# EAGLE design os21_diy (EAGLE 6.5.0)
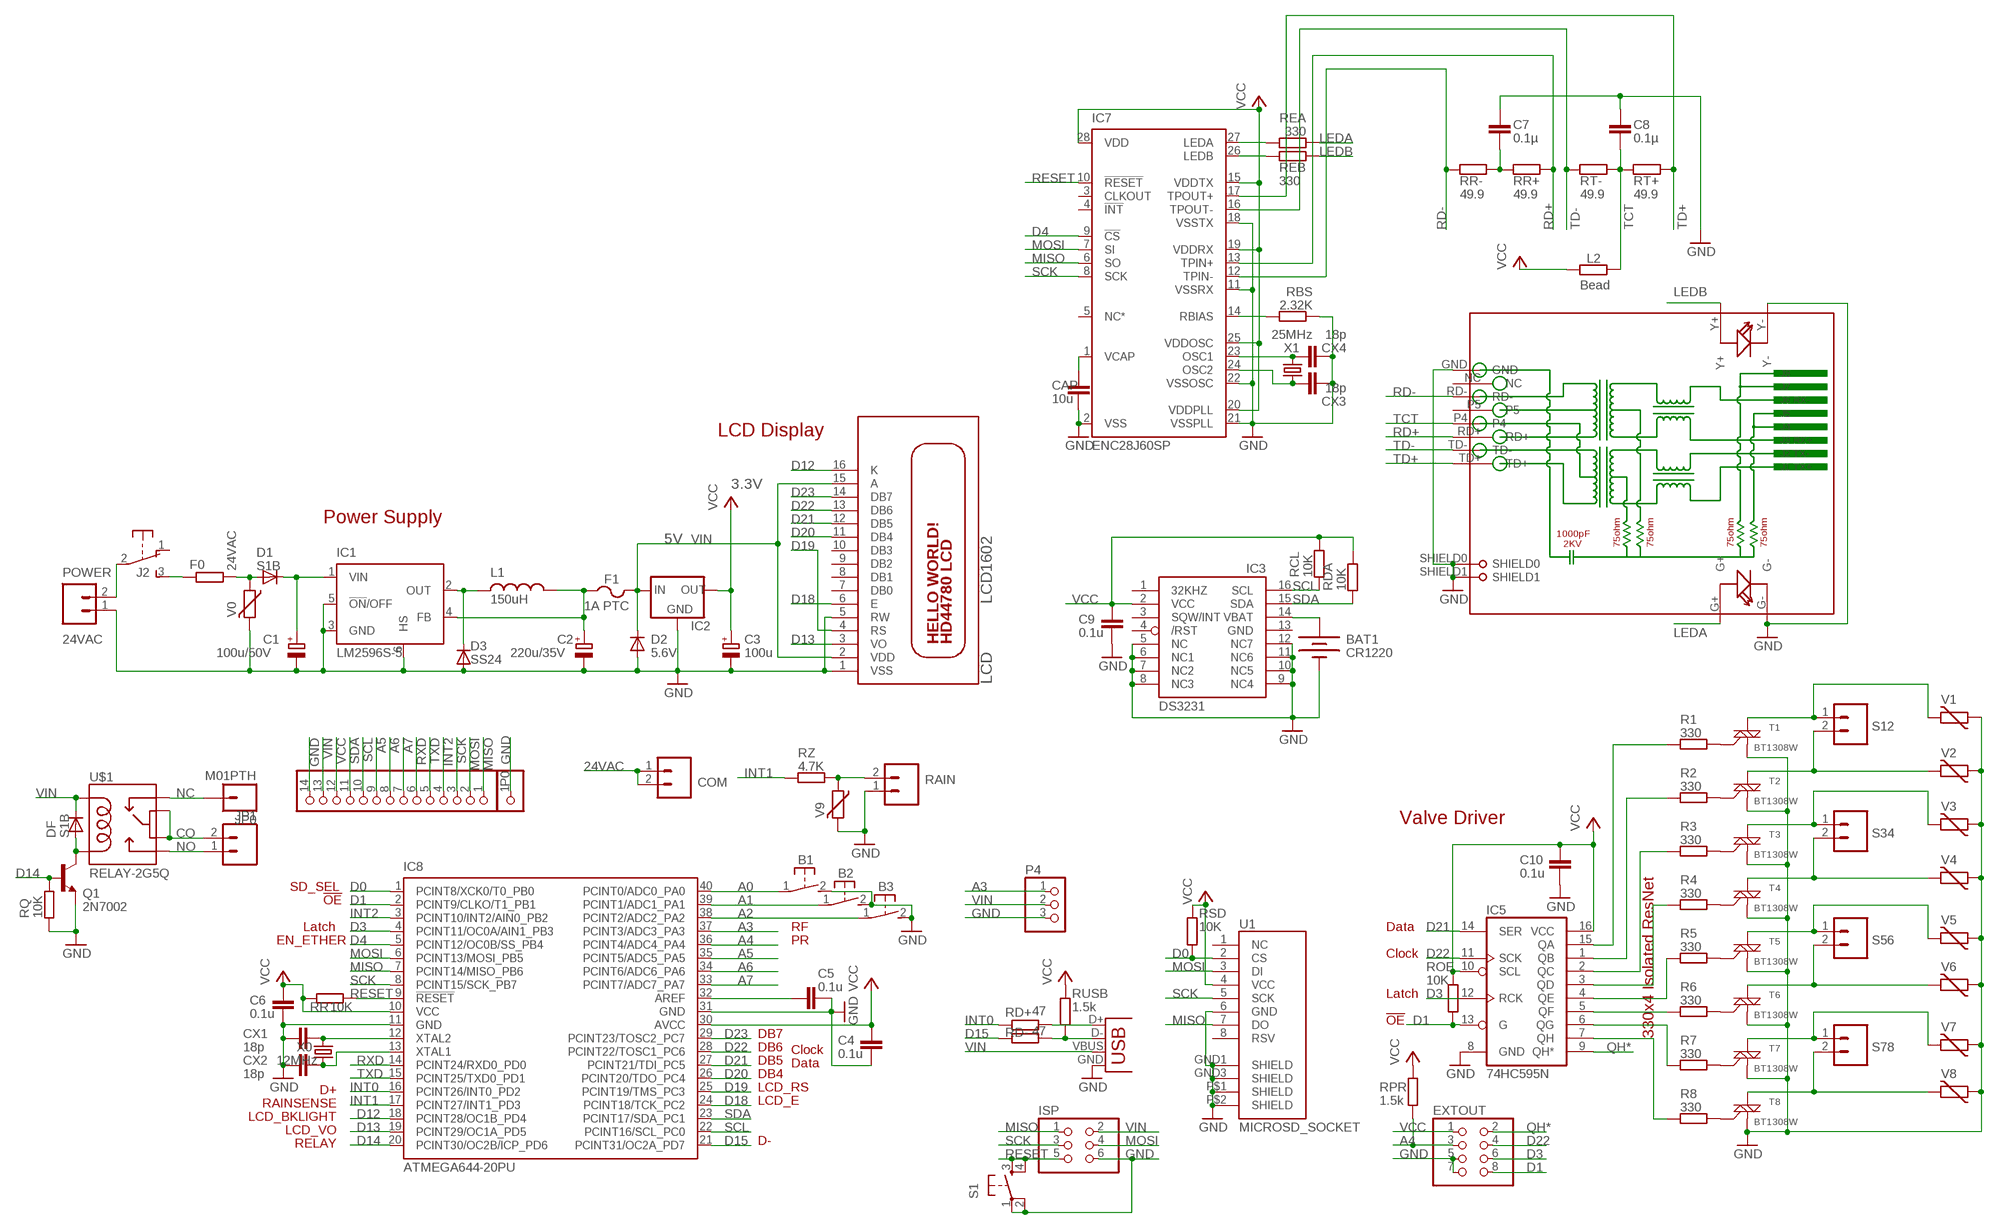
[diagram p0: schematic, sheet 1]

## Parts
B1  31-XX  [B3F-31XX]
B2  31-XX  [B3F-31XX]
B3  31-XX  [B3F-31XX]
BAT1  CR1220  BATTERYBATTERY_12MM_SMT  [BATTCON_12MM_SMT]
C1  100u/50V  CPOL-EUE3.5-8  [E3,5-8]
C2  220u/35V  CPOL-EUE3.5-8  [E3,5-8]
C3  100u  CPOL-EUE2-5  [E2-5]
C4  0.1u  C-EUC0805  [C0805]
C5  0.1u  C-EUC0805  [C0805]
C6  0.1u  C-EUC0805  [C0805]
C7  0.1µ  C-EUC0805  [C0805]
C8  0.1µ  C-EUC0805  [C0805]
C9  0.1u  C-EUC0805  [C0805]
C10  0.1u  C-EUC0805  [C0805]
CAP  10u  C-EUC0805  [C0805]
COM  M025MM-X  [SCREWTERMINAL-5MM-2-X]
CX1  18p  C-EUC0805  [C0805]
CX2  18p  C-EUC0805  [C0805]
CX3  18p  C-EUC0805  [C0805]
CX4  18p  C-EUC0805  [C0805]
D1  S1B  DIODE-DO-214AC  [DO-214AC]
D2  5.6V  DIODE-MINIMELF  [MINIMELF]
D3  SS24  DIODE-DO-214AC  [DO-214AC]
DF  S1B  DIODE-DO-214AC  [DO-214AC]
EXTOUT  PINHD-2X4  [2X04]
F0  R-EU_0411/3V  [0411V]
F1  1A PTC  PTCFUSE-1812  [1812]
IC1  LM2596S-5  LM2596S  [TO263-5]
IC2  MCP1700SOT233  [SOT23]
IC3  DS3231/SO  [SO16W]
IC5  74HC595N  74LS595D  [SO16]
IC7  ENC28J60SP  [DIL28-3]
IC8  ATMEGA644-20PU  [DIL40]
ISP  PINHD-2X3  [2X03]
J2  EG1206  [EG1206]
JP0  M01PTH  [1X01]
JP1  M025MM-X  [SCREWTERMINAL-5MM-2-X]
L1  150uH  INDUCTORPWR  [CDRH125]
L2  Bead  R-EU_R0805  [R0805]
LCD  LCD1602  HD44780LCDNOHOLE  [LCD1602A]
P0  PINHD-1X14-CB  [1X14-CB]
P1  PINHD-1X1CB  [1X01-CLEANBIG]
P4  PINHD-1X3  [1X03]
POWER  24VAC  M024MM-X  [SCREWTERMINAL-4MM-2-X]
Q1  2N7002  TRANSISTOR_NPNSOT23-3  [SOT23-3]
R1  330  R-EU_R0805  [R0805]
R2  330  R-EU_R0805  [R0805]
R3  330  R-EU_R0805  [R0805]
R4  330  R-EU_R0805  [R0805]
R5  330  R-EU_R0805  [R0805]
R6  330  R-EU_R0805  [R0805]
R7  330  R-EU_R0805  [R0805]
R8  330  R-EU_R0805  [R0805]
RAIN  M025MM-X  [SCREWTERMINAL-5MM-2-X]
RBS  2.32K  R-EU_R0805  [R0805]
RCL  10K  R-EU_R0805  [R0805]
RD+  47  R-EU_R0805  [R0805]
RD-  47  R-EU_R0805  [R0805]
RDA  10K  R-EU_R0805  [R0805]
REA  330  R-EU_R0805  [R0805]
REB  330  R-EU_R0805  [R0805]
RJ45  HR911105A  [HR911105A]
ROE  10K  R-EU_R0805  [R0805]
RPR  1.5k  R-EU_R0805  [R0805]
RQ  10K  R-EU_R0805  [R0805]
RR  10K  R-EU_R0805  [R0805]
RR+  49.9  R-EU_R0805  [R0805]
RR-  49.9  R-EU_R0805  [R0805]
RSD  10K  R-EU_R0805  [R0805]
RT+  49.9  R-EU_R0805  [R0805]
RT-  49.9  R-EU_R0805  [R0805]
RUSB  1.5k  R-EU_R0805  [R0805]
RZ  4.7K  R-EU_R0805  [R0805]
S1  TAC_SWITCHSMD  [TACTILE_SWITCH_SMD]
S12  M025MM-X  [SCREWTERMINAL-5MM-2-X]
S34  M025MM-X  [SCREWTERMINAL-5MM-2-X]
S56  M025MM-X  [SCREWTERMINAL-5MM-2-X]
S78  M025MM-X  [SCREWTERMINAL-5MM-2-X]
T1  BT1308W  MAC97  [TO-92]
T2  BT1308W  MAC97  [TO-92]
T3  BT1308W  MAC97  [TO-92]
T4  BT1308W  MAC97  [TO-92]
T5  BT1308W  MAC97  [TO-92]
T6  BT1308W  MAC97  [TO-92]
T7  BT1308W  MAC97  [TO-92]
T8  BT1308W  MAC97  [TO-92]
U1  MICROSD_SOCKET  USD-SOCKETMICRO-SD-SOCKET-TAOBAO  [MICRO-SD-SOCKET-TAOBAO]
U$1  RELAY-2G5Q  [RELAY-G5V]
USB  USBPTH  [USB-B-PTH]
V0  MOV  VARISTOR-5  [R-5]
V1  MOV  VARISTOR-5  [R-5]
V2  MOV  VARISTOR-5  [R-5]
V3  MOV  VARISTOR-5  [R-5]
V4  MOV  VARISTOR-5  [R-5]
V5  MOV  VARISTOR-5  [R-5]
V6  MOV  VARISTOR-5  [R-5]
V7  MOV  VARISTOR-5  [R-5]
V8  MOV  VARISTOR-5  [R-5]
V9  MOV  VARISTOR-5  [R-5]
X0  12MHz  CRYSTALHC49UV  [HC49U-V]
X1  25MHz  CRYSTALHC49UV  [HC49U-V]

## Nets
24VAC [power]: COM.1 COM.2 D1.A F0.2 V0.1
A0: B1.1(P) IC8.40(PCINT0/ADC0_PA0)
A1: B2.1(P) IC8.39(PCINT1/ADC1_PA1)
A2: B3.1(P) IC8.38(PCINT2/ADC2_PA2)
A3: IC8.37(PCINT3/ADC3_PA3) P4.1
A4: EXTOUT.3 IC8.36(PCINT4/ADC4_PA4) RPR.1
A5: IC8.35(PCINT5/ADC5_PA5) P0.9
A6: IC8.34(PCINT6/ADC6_PA6) P0.8
A7: IC8.33(PCINT7/ADC7_PA7) P0.7
AREF: C5.1 IC8.32(AREF)
CO [power]: JP1.2 U$1.5 U$1.6
D0: IC8.1(PCINT8/XCK0/T0_PB0) RSD.1 U1.2(CS)
D1: EXTOUT.8 IC5.13(G) IC8.2(PCINT9/CLKO/T1_PB1) ROE.1
D3: EXTOUT.6 IC5.12(RCK) IC8.4(PCINT11/OC0A/AIN1_PB3)
D4: IC7.9(!CS) IC8.5(PCINT12/OC0B/SS_PB4)
D12: IC8.18(PCINT28/OC1B_PD4) LCD.16(K)
D13: IC8.19(PCINT29/OC1A_PD5) LCD.3(VO)
D14: IC8.20(PCINT30/OC2B/ICP_PD6) Q1.1(B) RQ.1
D15: IC8.21(PCINT31/OC2A_PD7) RD-.1
D18: IC8.24(PCINT18/TCK_PC2) LCD.6(E)
D19: IC8.25(PCINT19/TMS_PC3) LCD.4(RS)
D20: IC8.26(PCINT20/TDO_PC4) LCD.11(DB4)
D21: IC5.14(SER) IC8.27(PCINT21/TDI_PC5) LCD.12(DB5)
D22: EXTOUT.4 IC5.11(SCK) IC8.28(PCINT22/TOSC1_PC6) LCD.13(DB6)
D23: IC8.29(PCINT23/TOSC2_PC7) LCD.14(DB7)
GND: B1.2(S) B2.2(S) B3.2(S) BAT1.P$1(-) C1.- C2.- C3.- C4.2 C5.2 C6.2 C7.1 C8.1 C9.2 C10.2 CAP.2 CX1.2 CX2.2 CX3.2 CX4.2 D2.A D3.A EXTOUT.5 EXTOUT.7 IC1.3(GND) IC1.5(!ON!/OFF) IC1.6(HS) IC2.1(GND) IC3.5(NC) IC3.6(NC1) IC3.7(NC2) IC3.8(NC3) IC3.9(NC4) IC3.10(NC5) IC3.11(NC6) IC3.12(NC7) IC5.8(GND) IC7.2(VSS) IC7.11(VSSRX) IC7.18(VSSTX) IC7.21(VSSPLL) IC7.22(VSSOSC) IC8.11(GND) IC8.31(GND) ISP.6 LCD.1(VSS) LCD.5(RW) P0.14 P1.1 P4.3 POWER.1 Q1.2(E) RAIN.1 RBS.2 RJ45.G- RJ45.GND RJ45.SHIELD0 RJ45.SHIELD1 RJ45.Y- RQ.2 S1.1 S1.2 T1.1(M1) T2.1(M1) T3.1(M1) T4.1(M1) T5.1(M1) T6.1(M1) T7.1(M1) T8.1(M1) U1.6(GND) U1.GND1(SHIELD) U1.GND3(SHIELD) U1.P$1(SHIELD) U1.P$2(SHIELD) USB.GND V0.2 V1.1 V2.1 V3.1 V4.1 V5.1 V6.1 V7.1 V8.1 V9.2
INT0: IC8.16(PCINT26/INT0_PD2) RD+.1
INT1: IC8.17(PCINT27/INT1_PD3) RZ.2
INT2: IC8.3(PCINT10/INT2/AIN0_PB2) P0.4
LEDA: REA.2 RJ45.G+
LEDB: REB.2 RJ45.Y+
MISO: IC7.6(SO) IC8.7(PCINT14/MISO_PB6) ISP.1 P0.1 U1.7(DO)
MOSI: IC7.7(SI) IC8.6(PCINT13/MOSI_PB5) ISP.4 P0.2 U1.3(DI)
N$1 [power]: C1.+ D1.C IC1.1(VIN)
N$2 [power]: C2.+ F1.1 IC1.4(FB) L1.2
N$3: R1.1 T1.2(G)
N$4: IC5.5(QF) R6.2
N$5: IC5.6(QG) R7.2
N$6 [power]: J2.2(P) POWER.2
N$7: IC5.7(QH) R8.2
N$8: BAT1.P$2(+) IC3.14(VBAT)
N$9 [power]: D3.C IC1.2(OUT) L1.1
N$10: IC5.4(QE) R5.2
N$11: IC5.3(QD) R4.2
N$12: IC5.2(QC) R3.2
N$13: IC5.1(QB) R2.2
N$14: IC5.15(QA) R1.2
N$15: R2.1 T2.2(G)
N$16 [power]: S12.1 T1.3(M2) V1.2
N$17 [power]: S12.2 T2.3(M2) V2.2
N$18 [power]: S34.1 T3.3(M2) V3.2
N$19: IC7.14(RBIAS) RBS.1
N$20 [power]: S34.2 T4.3(M2) V4.2
N$21: R3.1 T3.2(G)
N$22 [power]: S56.1 T5.3(M2) V5.2
N$23 [power]: S56.2 T6.3(M2) V6.2
N$24 [power]: S78.1 T7.3(M2) V7.2
N$25 [power]: S78.2 T8.3(M2) V8.2
N$26: R4.1 T4.2(G)
N$27: R5.1 T5.2(G)
N$28: R6.1 T6.2(G)
N$29: R7.1 T7.2(G)
N$31: RAIN.2 RZ.1 V9.1
N$32 [power]: F0.1 J2.3(S)
N$33: CAP.1 IC7.1(VCAP)
N$34: IC7.27(LEDA) REA.1
N$35: DF.A Q1.3(C) U$1.9
N$37: IC7.26(LEDB) REB.1
N$38: RD+.2 USB.D+
N$41: CX3.1 IC7.24(OSC2) X1.2
N$42: CX4.1 IC7.23(OSC1) X1.1
N$43: R8.1 T8.2(G)
N$45: RD-.2 RUSB.1 USB.D-
N$46: CX1.1 IC8.12(XTAL2) X0.2
N$47: CX2.1 IC8.13(XTAL1) X0.1
N$54: C7.2 RR+.1 RR-.2
NC [power]: JP0.1 U$1.1
NO [power]: JP1.1 U$1.10
QH*: EXTOUT.2 IC5.9(QH*)
RD+: IC7.13(TPIN+) RJ45.RD+ RR+.2
RD-: IC7.12(TPIN-) RJ45.RD- RR-.1
RESET: IC7.10(!RESET) IC8.9(!RESET) ISP.5 RR.2 S1.3 S1.4
RXD: IC8.14(PCINT24/RXD0_PD0) P0.6
SCK: IC7.8(SCK) IC8.8(PCINT15/SCK_PB7) ISP.3 P0.3 U1.5(SCK)
SCL: IC3.16(SCL) IC8.22(PCINT16/SCL_PC0) P0.10 RCL.2
SDA: IC3.15(SDA) IC8.23(PCINT17/SDA_PC1) P0.11 RDA.2
TCT: C8.2 L2.1 RJ45.P4 RT+.1 RT-.2
TD+: IC7.17(TPOUT+) RJ45.TD+ RT+.2
TD-: IC7.16(TPOUT-) RJ45.TD- RT-.1
TXD: IC8.15(PCINT25/TXD0_PD1) P0.5
VCC: C3.+ C4.1 C6.1 C9.1 C10.1 EXTOUT.1 IC2.2(OUT) IC3.2(VCC) IC5.10(SCL) IC5.16(VCC) IC7.15(VDDTX) IC7.19(VDDRX) IC7.20(VDDPLL) IC7.25(VDDOSC) IC7.28(VDD) IC8.10(VCC) IC8.30(AVCC) L2.2 P0.12 RCL.1 RDA.1 ROE.2 RPR.2 RR.1 RSD.2 RUSB.2 U1.4(VCC)
VIN [power]: D2.C DF.C F1.2 IC2.3(IN) ISP.2 LCD.2(VDD) LCD.15(A) P0.13 P4.2 U$1.2 USB.VBUS
Unconnected: IC3.1(32KHZ) IC3.3(SQW/INT) IC3.4(/RST) IC7.3(CLKOUT) IC7.4(!INT) IC7.5(NC*) J2.1(O) LCD.7(DB0) LCD.8(DB1) LCD.9(DB2) LCD.10(DB3) RJ45.NC RJ45.P5 U1.1(NC) U1.8(RSV)

## Notes on the sheet
- LCD Display
- 3.3V
- Power Supply
- 5V
- Valve Driver
- SD_SEL
- !OE
- Latch | RF | Data
- EN_ETHER | PR
- Clock
- Latch
- !OE
- DB7 | 330x4 Isolated ResNet
- Clock
- DB6
- Data
- DB5
- DB4
- D+
- LCD_RS
- RAINSENSE
- LCD_E
- LCD_BKLIGHT
- LCD_VO
- RELAY
- D-

## Power pins joined to a net without a drawn wire
GND: IC3.13(GND)

## Library data of the parts
B1-B3 = adafruit:31-XX: OMRON SWITCH Now with beefier pads!
BAT1 = SparkFunNew:BATTERY: Battery Holders Various common sizes : AA, AAA, 20mm coin cell and 12mm coin cell.
C1-C3 = resistor:CPOL-EU: POLARIZED CAPACITOR, European symbol
C4-C6 C9 C10 = rcl:C-EU: CAPACITOR, European symbol
C7 C8 CAP CX1-CX4 = resistor:C-EU: CAPACITOR, European symbol
COM JP1 POWER RAIN S12 S34 S56 S78 = SparkFun:M02: Header 2 Standard 2-pin 0.1" header. Use with straight break away headers (SKU : PRT-00116), right angle break away headers (PRT-00553), swiss pins (PRT-00743), machine pins (PRT-00117), and female headers (PRT-00115). Molex polarized connector foot print use with SKU : PRT-08233 with associated crimp pins and housings.
D1-D3 DF = diode:DIODE-: DIODE
EXTOUT = pinhead:PINHD-2X4: PIN HEADER
F0 L2 R1-R8 RBS RCL RD+ RD- RDA REA REB ROE RPR RQ RR RR+ RR- RSD RT+ RT- RUSB RZ = rcl:R-EU_: RESISTOR, European symbol
F1 = adafruit:PTCFUSE: PTC fuses, resettable thermistors
IC1 = national-semiconductor:LM2596: SIMPLE SWITCHER® Power Converter 150 kHz 3A Step-Down Voltage Regulator Source: http://www.national.com/ds/LM/LM2596.pdf; MF: NATIONAL SEMICONDUCTOR; MPN: LM2596S-ADJ/NOPB; OC_FARNELL: 9494367; OC_NEWARK: 41K3842
IC2 = adafruit:MCP1700: VOLTAGE REGULATOR
IC3 = adafruit2013:DS3231
IC5 = SparkFun:74*595: 8-bit SHIFT REGISTER, output latch
IC7 = microchip:ENC28J60: Stand-Alone Ethernet Controller with SPI Interface Source: http://ww1.microchip.com/downloads/en/DeviceDoc/39662c.pdf; MF: MICROCHIP; MPN: ENC28J60/SP; OC_FARNELL: 1084619; OC_NEWARK: 96K3661
IC8 = atmel:ATMEGA644-*PU: 8-bit Microcontroller with 64K Bytes In-System Programmable Flash Auto generated by make-symbol-device-package-bsdl.ulp Rev. 34 Source: http://www.atmel.com/dyn/resources/prod_documents/doc2593.pdf; MPN: ATMEGA644-20PU; OC_FARNELL: 1288340; OC_NEWARK: 23M5060
ISP = pinhead:PINHD-2X3: PIN HEADER
J2 = adafruit:EG1206
JP0 = SparkFun:M01: Header 1 Standard 1-pin 0.1" header. Use with straight break away headers (SKU : PRT-00116), right angle break away headers (PRT-00553), swiss pins (PRT-00743), machine pins (PRT-00117), and female headers (PRT-00115).
L1 = SparkFunNew:INDUCTOR: Inductors Basic Inductor/Choke - 0603 and 1206. Footprints are not proven and vary greatly between part numbers.
LCD = adafruit:HD44780LCD: HD44780 LCD Standard character type LCDs, available in sizes from 8x1 to 40x4!
P0 = adafruit:PINHD-1X14: PIN HEADER
P1 = adafruit:PINHD-1X1: Pin header 1x1 for 0.1" spacing With round pins
P4 = pinhead:PINHD-1X3: PIN HEADER
Q1 = SparkFunNew:TRANSISTOR_NPN: Transistor NPN BJT configuration in SOT23 package. MMBT2222 is the common NPN we use. Double check BCE configuration again layout.
RJ45 = CONNECTER:HR911105A
S1 = SparkFunNew:TAC_SWITCH: Momentary Switch Button commonly used for reset or general input. Spark Fun Electronics SKU : COM-00097
T1-T8 = SparkFun:MAC97: MAC97 Triac http://www.onsemi.com/pub_link/Collateral/MAC97-D.PDF
U1 = SparkFunNew:USD-SOCKET: microSD Socket Push-push type uSD socket. Schematic element and footprint production proven. Spark Fun Electronics SKU : PRT-00127. tDoc lines correctly indicate media card edge positions when inserting (unlocked, locked, depressed).
U$1 = SparkFunNew:RELAY-2
USB = SparkFunNew:USB: USB Connectors USB-B-PTH is fully proven SKU : PRT-00139 USB-miniB is fully proven SKU : PRT-00587 USB-A-PCB is untested. USB-A-H is throughly reviewed, but untested. Spark Fun Electronics SKU : PRT-00437 USB-B-SMT is throughly reviewed, but untested. Needs silkscreen touching up. USB-A-S has not been used/tested USB-MB-H has not been used/tested
V0 V1-V9 = varistor:VARISTOR: VARISTOR
X0 X1 = SparkFun:CRYSTAL: Crystals Various standard crystals. Proven footprints. Spark Fun Electronics SKU : COM-00534

## Net classes
0 default: width 0.305 mm, clearance 0.203 mm
1 power: width 0.508 mm, clearance 0.203 mm

## Board
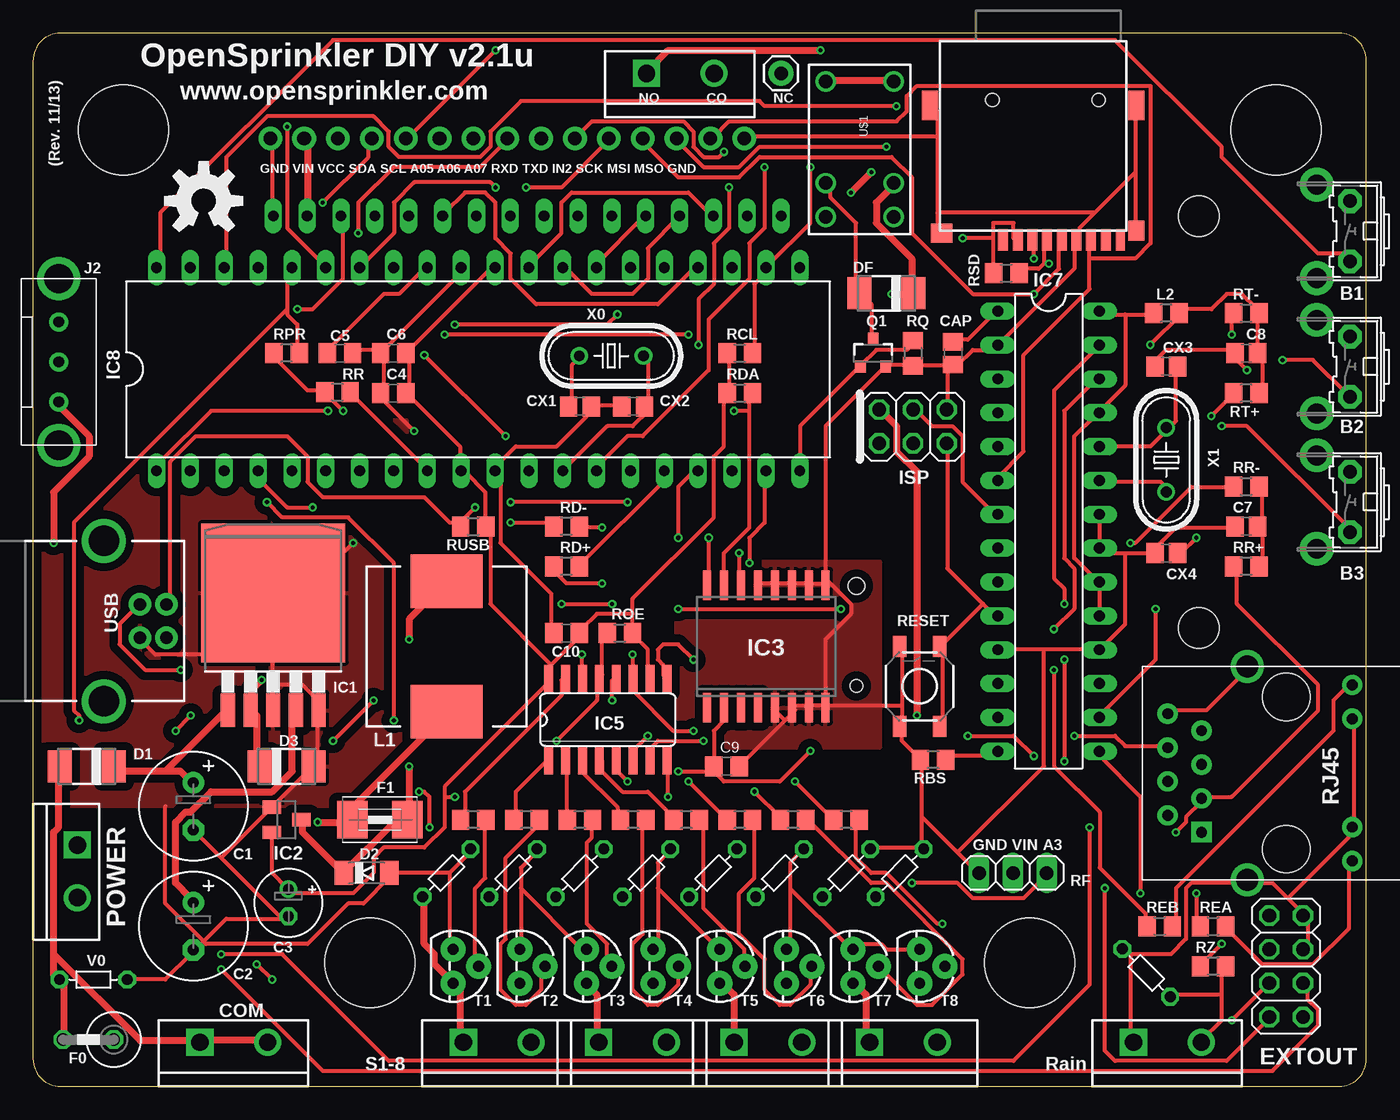
[diagram p1: board, top side]
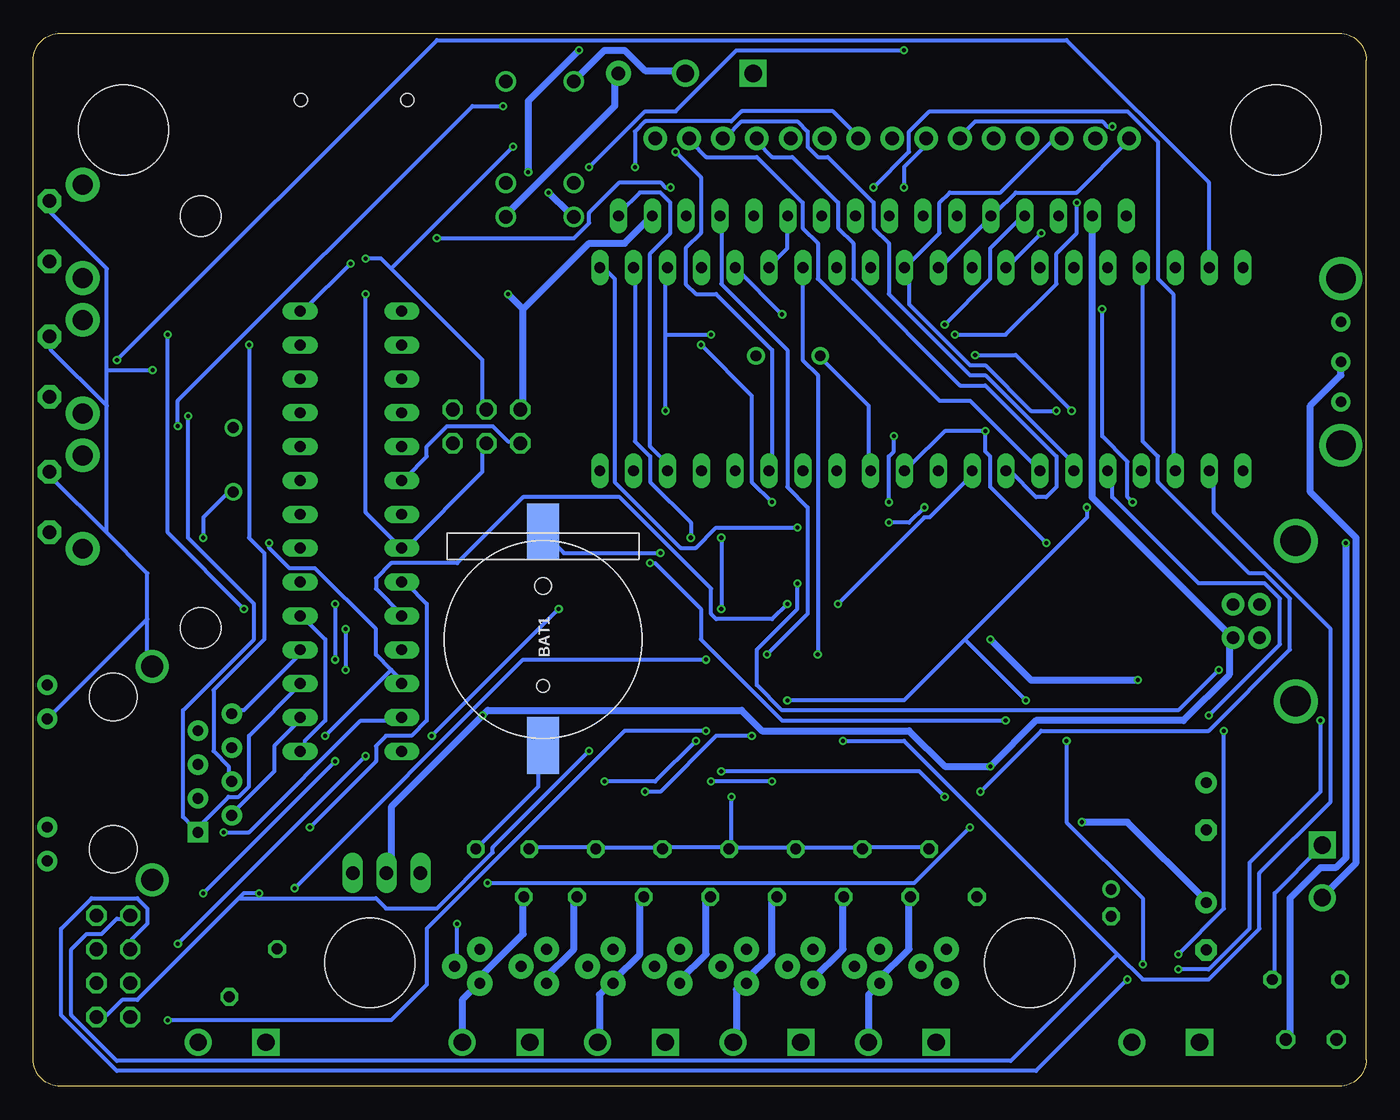
[diagram p2: board, bottom side, seen from below]

Size 100 x 79 mm. Coordinates in mm from the lower left corner, seen from the top.
Outline: 98,79 2,79 arc90 0,77 0,2 arc90 2,0 98,0 arc90 100,2 100,77 arc90 98,79
Copper layers (1*16): Top 0.035mm / dielectric 1.5mm / Bottom 0.035mm
Design rules "Fusion_eagle_rule_v1.1": minimum track width 6mil, minimum drill 12mil, track to track 6mil, track to pad 6mil, pad to pad 6mil, via to via 6mil, smd to smd 0mil, copper to edge 10mil, drill to drill 10mil, minimum pad ring 10mil, minimum via ring 6mil, stop-mask expansion 2mil, vias tented up to drill 100mil, thermal gap 10mil
Holes 3.05 mm at 87.46,65.3 87.46,34.38
Holes 6.75 mm at 6.76,71.74 93.24,71.74 25.26,9.26 74.74,9.26
tRestrict: area 84.4,31.3 to 90.5,37.4; area 84.4,62.2 to 90.5,68.3; area 2.8,67.7 to 10.8,75.7; area 89.2,67.7 to 97.2,75.7; area 21.3,5.3 to 29.3,13.3; area 70.7,5.3 to 78.7,13.3
bRestrict: area 2.8,67.7 to 10.8,75.7; area 89.2,67.7 to 97.2,75.7; area 21.3,5.3 to 29.3,13.3; area 70.7,5.3 to 78.7,13.3; area 84.4,62.2 to 90.5,68.3; area 84.4,31.3 to 90.5,37.4
vRestrict: area 17,68 to 54.5,69.5; area 70,17.5 to 77,18.5

### Footprints (pad centres in the part's own frame; a part is rotated, then mirrored left to right if it is on the bottom)
B3F-31XX = drill 1.016 pad 1.778 octagon: 1 -2.261,-1.245; 2 2.261,-1.245 | drill 1.499 pad 2.54: 3 -3.505,1.245; 4 3.505,1.245
BATTCON_12MM_SMT = smd 2.4 x 4.3: P$1 0,11.96 | smd 2.4 x 4.2: P$2 0,-4.1 | hole 0.95: 0,7.5 | hole 1.25: 0,0
E3,5-8 = drill 0.813 pad 1.6: + -1.778,0 | drill 0.813 pad 1.6 octagon: - 1.778,0
E2-5 = drill 0.813 pad 1.27: + -1.016,0 | drill 0.813 pad 1.27 octagon: - 1.016,0
C0805 = smd 1.3 x 1.5: 1 -0.95,0; 2 0.95,0
C0805' = smd 1.3 x 1.5: 1 -0.85,0; 2 0.85,0
SCREWTERMINAL-5MM-2-X = drill 1.3 pad 2.032 square: 1 0,0 | drill 1.3 pad 2.032: 2 5.08,0
DO-214AC = smd 1.8 x 2.4: A 2.025,0; C -2.025,0
MINIMELF = smd 1.4 x 1.8: A 1.7,0; C -1.7,0
2X04 = drill 1.016 octagon: 1 -3.81,-1.27; 2 -3.81,1.27; 3 -1.27,-1.27; 4 -1.27,1.27; 5 1.27,-1.27; 6 1.27,1.27; 7 3.81,-1.27; 8 3.81,1.27
0411V = drill 0.914 octagon: 1 -2.54,0; 2 1.27,0
1812 = smd 2.286 x 2.794: 1 -2.046,0; 2 2.046,0
TO263-5 = smd 1.067 x 2.54: 1 -3.404,-5.791; 2 -1.702,-5.791; 3 0,-5.791; 4 1.702,-5.791; 5 3.404,-5.791 | smd 10.8 x 10.41: 6 0,3
SOT23 = smd 1 x 1.4: 1 -0.95,-1.1; 2 0.95,-1.1; 3 0,1.1
SO16W = smd 0.6 x 2.2: 1 -4.445,-4.6; 2 -3.175,-4.6; 3 -1.905,-4.6; 4 -0.635,-4.6; 5 0.635,-4.6; 6 1.905,-4.6; 7 3.175,-4.6; 8 4.445,-4.6; 9 4.445,4.6; 10 3.175,4.6; 11 1.905,4.6; 12 0.635,4.6; 13 -0.635,4.6; 14 -1.905,4.6; 15 -3.175,4.6; 16 -4.445,4.6
SO16 = smd 0.66 x 2.032: 1 -4.445,-3.073; 2 -3.175,-3.073; 3 -1.905,-3.073; 4 -0.635,-3.073; 5 0.635,-3.073; 6 1.905,-3.073; 7 3.175,-3.073; 8 4.445,-3.073; 9 4.445,3.073; 10 3.175,3.073; 11 1.905,3.073; 12 0.635,3.073; 13 -0.635,3.073; 14 -1.905,3.073; 15 -3.175,3.073; 16 -4.445,3.073
DIL28-3 = drill 0.813 long: 1 -16.51,-3.81; 2 -13.97,-3.81; 3 -11.43,-3.81; 4 -8.89,-3.81; 5 -6.35,-3.81; 6 -3.81,-3.81; 7 -1.27,-3.81; 8 1.27,-3.81; 9 3.81,-3.81; 10 6.35,-3.81; 11 8.89,-3.81; 12 11.43,-3.81; 13 13.97,-3.81; 14 16.51,-3.81; 15 16.51,3.81; 16 13.97,3.81; 17 11.43,3.81; 18 8.89,3.81; 19 6.35,3.81; 20 3.81,3.81; 21 1.27,3.81; 22 -1.27,3.81; 23 -3.81,3.81; 24 -6.35,3.81; 25 -8.89,3.81; 26 -11.43,3.81; 27 -13.97,3.81; 28 -16.51,3.81
DIL40 = drill 0.813 long: 1 -24.13,-7.62; 2 -21.59,-7.62; 3 -19.05,-7.62; 4 -16.51,-7.62; 5 -13.97,-7.62; 6 -11.43,-7.62; 7 -8.89,-7.62; 8 -6.35,-7.62; 9 -3.81,-7.62; 10 -1.27,-7.62; 11 1.27,-7.62; 12 3.81,-7.62; 13 6.35,-7.62; 14 8.89,-7.62; 15 11.43,-7.62; 16 13.97,-7.62; 17 16.51,-7.62; 18 19.05,-7.62; 19 21.59,-7.62; 20 24.13,-7.62; 21 24.13,7.62; 22 21.59,7.62; 23 19.05,7.62; 24 16.51,7.62; 25 13.97,7.62; 26 11.43,7.62; 27 8.89,7.62; 28 6.35,7.62; 29 3.81,7.62; 30 1.27,7.62; 31 -1.27,7.62; 32 -3.81,7.62; 33 -6.35,7.62; 34 -8.89,7.62; 35 -11.43,7.62; 36 -13.97,7.62; 37 -16.51,7.62; 38 -19.05,7.62; 39 -21.59,7.62; 40 -24.13,7.62
2X03 = drill 1.016 octagon: 1 -2.54,-1.27; 2 -2.54,1.27; 3 0,-1.27; 4 0,1.27; 5 2.54,-1.27; 6 2.54,1.27
EG1206 = drill 0.8 pad 1.422: 1 -3,0; 2 0,0; 3 3,0 | drill 2.2: MT1 -6.25,0; MT2 6.25,0
1X01 = drill 1.016 pad 1.88: 1 0,0
CDRH125 = smd 5.4 x 4: 1 0,4.9; 2 0,-4.9
R0805 = smd 1.3 x 1.5: 1 -0.95,0; 2 0.95,0
LCD1602A = drill 0.8 long: 1 8,33.46; 2 10.54,33.46; 3 13.08,33.46; 4 15.62,33.46; 5 18.16,33.46; 6 20.7,33.46; 7 23.24,33.46; 8 25.78,33.46; 9 28.32,33.46; 10 30.86,33.46; 11 33.4,33.46; 12 35.94,33.46; 13 38.48,33.46; 14 41.02,33.46; 15 43.56,33.46; 16 46.1,33.46
1X14-CB = drill 1.016 pad 1.778: 1 -16.51,0; 2 -13.97,0; 3 -11.43,0; 4 -8.89,0; 5 -6.35,0; 6 -3.81,0; 7 -1.27,0; 8 1.27,0; 9 3.81,0; 10 6.35,0; 11 8.89,0; 12 11.43,0; 13 13.97,0; 14 16.51,0
1X01-CLEANBIG = drill 1.016 pad 1.778: 1 0,0
1X03 = drill 1.016 long: 1 -2.54,0; 2 0,0; 3 2.54,0
SCREWTERMINAL-4MM-2-X = drill 1.3 pad 2.032 square: 1 0,0 | drill 1.3 pad 2.032: 2 3.96,0
SOT23-3 = smd 0.8 x 0.9: 1 -0.95,-1; 2 0.95,-1; 3 0,1.1
HR911105A = drill 0.813 pad 1.524: G+ 4.953,-6.604; G- 4.953,-4.064; GND -8.89,4.445; NC -6.35,3.175; P4 -8.89,-0.635; P5 -6.35,0.635; RD+ -6.35,-1.905; RD- -8.89,1.905; TD- -8.89,-3.175; Y+ 4.953,6.604; Y- 4.953,4.064 | drill 1.651 pad 2.159: SHIELD0 -2.921,8.001; SHIELD1 -2.921,-8.001 | drill 0.813 pad 1.524 square: TD+ -6.35,-4.445 | hole 3.556: 0,-5.715; 0,5.715
TACTILE_SWITCH_SMD = smd 1.6 x 1: 1 -3,1.5; 2 3,1.5; 3 -3,-1.5; 4 3,-1.5
TO-92 = drill 0.813 pad 1.88: 1 -1.27,0; 2 0,1.905; 3 1.27,0
MICRO-SD-SOCKET-TAOBAO = smd 0.75 x 1.6: 1 2.25,10.5; 2 1.15,10.5; 3 0.05,10.5; 4 -1.05,10.5; 5 -2.15,10.5; 6 -3.25,10.5; 7 -4.35,10.5; 8 -5.45,10.5 | smd 0.7 x 1.6: CD -6.55,10.5 | smd 1.2 x 1.5: GND1 -7.75,9.8 | smd 1.6 x 1.4: GND3 6.85,10 | smd 1.2 x 2.2: P$1 7.75,0.4; P$2 -7.75,0.4 | hole 1: 3.05,0; -4.93,0
RELAY-G5V = drill 1.016: 1 5.08,2.54; 2 2.54,2.54; 5 -5.08,2.54; 6 -5.08,-2.54; 9 2.54,-2.54; 10 5.08,-2.54
USB-B-PTH = drill 0.914 pad 1.676: D+ 0,1.25; D- 1.981,1.25; GND 0,-1.25; VBUS 1.981,-1.25 | drill 2.286: S1 -2.718,-6.02; S2 -2.718,6.02
R-5 = drill 0.813 octagon: 1 -2.54,0; 2 2.54,0
HC49U-V = drill 0.813: 1 -2.413,0; 2 2.413,0

### Placement (x,y rotation side)
B1  97.54,64.15 90 top
B2  97.54,53.99 90 top
B3  97.54,43.83 90 top
BAT1  61.75,37.52 180 bottom
C1  12,21 270 top
C2  12,12 270 top
C3  19.14,13.76 270 top
C4  27,52 180 top
C5  23,55 0 top
C6  27,55 180 top
C7  0.1µ  [C0805']  91,42 0 top
C8  0.1µ  [C0805']  91,55 0 top
C9  52,24 0 top
C10  40,34 180 top
CAP  10u  [C0805']  69,55 270 top
COM  12.5,3.3 0 top
CX1  18p  [C0805']  41,51 0 top
CX2  18p  [C0805']  45,51 180 top
CX3  18p  [C0805']  85,54 180 top
CX4  18p  [C0805']  85,40 180 top
D1  4,24 180 top
D2  25,16 0 top
D3  19,24 0 top
DF  64,59.5 180 top
EXTOUT  94,9 90 top
F0  3.5,3.5 180 top
F1  26,20 0 top
IC1  18,34 0 top
IC2  19,20 270 top
IC3  55,33 0 top
IC5  43.1,27.5 0 top
IC7  76.17,41.64 270 top
IC8  33.37,53.8 0 top
ISP  66,49.5 0 top
J2  1.9,54.34 270 top
JP0  56.1,76 0 top
JP1  46,76 0 top
L1  31,33 0 top
L2  85,58 180 top
LCD  10,31.84 0 top
P0  34.29,71.12 180 top
P1  53.34,71.12 0 top
P4  73.5,16 180 top
POWER  3.3,18.1 270 top
Q1  63,55 0 top
R1  33,20 180 top
R2  37,20 180 top
R3  41,20 180 top
R4  45,20 180 top
R5  49,20 180 top
R6  53,20 180 top
R7  57,20 180 top
R8  61,20 180 top
RAIN  82.55,3.3 0 top
RBS  67.5,24.5 180 top
RCL  53,55 0 top
RD+  40,39 180 top
RD-  40,42 180 top
RDA  53,52 0 top
REA  88.5,12 0 top
REB  84.5,12 0 top
RJ45  94,23.5 0 top
ROE  44,34 0 top
RPR  19,55 180 top
RQ  66,55 270 top
RR  22.82,52.08 0 top
RR+  91,39 180 top
RR-  91,45 0 top
RSD  73,61 0 top
RT+  91,52 180 top
RT-  91,58 0 top
RUSB  33,42 0 top
RZ  88.5,9 180 top
S1  66.5,30 90 top
S12  32.26,3.3 0 top
S34  42.42,3.3 0 top
S56  52.58,3.3 0 top
S78  62.74,3.3 0 top
T1  31.5,9 270 top
T2  36.5,9 270 top
T3  41.5,9 270 top
T4  46.5,9 270 top
T5  51.5,9 270 top
T6  56.5,9 270 top
T7  61.5,9 270 top
T8  66.5,9 270 top
U1  75,74 180 top
U$1  62,70.3 270 top
USB  8,34.9 0 top
V0  4.5,8 0 top
V1  31,16 225 top
V2  36,16 225 top
V3  41,16 225 top
V4  46,16 225 top
V5  51,16 225 top
V6  56,16 225 top
V7  61,16 225 top
V8  65,16 225 top
V9  83.5,8.5 135 top
X0  43.37,54.8 180 top
X1  85,47 90 top

### Tracks (layer width: path | path; a pad name or v marks a point on that pad's centre or on a via)
24VAC
  Top 0.508: COM.2 17.53,3.43 12.57,3.43 COM.1 12.19,3.43 8,3.43 1.52,9.91 | 1.52,9.91 1.52,8.38 1.91,8 V0.1 2.29,7.62 2.29,3.81 F0.2 | 1.52,9.91 1.52,19.05 1.91,19.43 1.91,23.62 D1.A
A0
  Top 0.305: IC8.40 9.53,61.72 9.53,65.53 22.48,78.49 81.15,78.49 89.15,70.48 89.15,69.72 96.39,62.48 98.3,62.48 98.68,62.1 B1.1
A1  (via drill 0.3)
  Top 0.305: v93.73,54.48 96.01,54.48 98.68,51.82 B2.1
  Bottom 0.305: v93.73,54.48 69.72,78.49 22.48,78.49 11.81,67.82 11.81,61.72 IC8.39
A2  (via drill 0.3)
  Top 0.305: v64.77,73.53 54.86,73.53 54.48,73.91 36.58,73.91 34.29,71.63 34.29,70.48 33.53,69.72 27.43,69.72 26.67,70.48 26.67,71.63 25.53,72.77 17.53,72.77 14.48,69.72 14.48,61.72 IC8.38 | v89.15,49.53 91.06,49.53 98.68,41.91 B3.1
  Bottom 0.305: v64.77,73.53 67.06,73.53 89.15,51.44 v89.15,49.53
A3  (via drill 0.3)
  Top 0.305: v28.96,22.1 29.34,22.1 29.72,21.72 v29.72,19.43 | v65.91,15.24 69.34,15.24 70.48,14.1 74.3,14.1 75.82,15.62 P4.1
  Bottom 0.305: v28.96,22.1 24.38,26.67 11.81,26.67 5.71,32.77 5.71,36.58 7.62,38.48 8.76,38.48 15.62,45.34 15.62,47.24 16.76,48.39 16.76,61.34 IC8.37 | v29.72,19.43 33.91,15.24 v65.91,15.24
A4  (via drill 0.3)
  Top 0.305: 19.05,58.29 19.05,61.34 IC8.36 | 19.05,58.29 19.05,57.91 19.81,57.15 19.81,55.24 RPR.1 | v14.1,8.76 21.72,1.14 92.96,1.14 96.39,4.57 96.39,5.71 95.63,6.48 95.63,7.62 EXTOUT.3 | v3.43,27.43 3.43,27.81 3.05,28.19 3.05,42.29 19.05,58.29
  Bottom 0.305: v14.1,8.76 11.81,8.76 8.76,11.81 8.76,16.76 3.43,22.1 v3.43,27.43
A5  (via drill 0.3)
  Top 0.305: v19.05,72.01 19.05,64.39 21.72,61.72 IC8.35
  Bottom 0.305: v19.05,72.01 19.43,72.01 19.81,72.39 29.34,72.39 30.48,71.25 P0.9
A6  (via drill 0.3)
  Top 0.305: v34.67,67.44 34.29,67.82 28.57,67.82 27.05,66.29 27.05,64.01 24.77,61.72 IC8.34
  Bottom 0.305: v34.67,67.44 34.67,68.96 32.77,70.87 P0.8
A7  (via drill 0.3)
  Top 0.305: v24.38,64.01 24.38,66.29 27.05,68.96 33.53,68.96 35.43,70.87 P0.7
  Bottom 0.305: v24.38,64.01 26.67,61.72 IC8.33
AREF
  Top 0.305: C5.1 22.1,55.24 26.29,59.44 27.43,59.44 29.34,61.34 IC8.32
CO
  Top 0.508: U$1.6 59.82,75.44 64.39,75.44 U$1.5
  Bottom 0.508: JP1.2 51.44,76.2 54.1,76.2 55.63,77.72 57.15,77.72 59.44,75.44 U$1.6
D0  (via drill 0.3)
  Top 0.305: 72.01,63.63 72.01,64.77 73.53,64.77 73.53,63.63 U1.2 | 72.01,63.63 72.01,61.34 RSD.1 | v22.1,50.67 13.34,50.67 9.53,46.86 9.53,46.48 IC8.1 | v35.43,48.77 v29.34,54.86 | v44.58,43.81 v35.81,43.81 | v49.91,55.63 49.91,59.05 51.05,60.2 51.05,63.25 52.2,64.39 v52.2,67.44 | 72.01,63.63 v69.72,63.63
  Bottom 0.305: v22.1,50.67 26.29,54.86 v29.34,54.86 | v35.43,48.77 35.43,47.62 35.81,47.24 v35.81,43.81 | v44.58,43.81 46.1,45.34 46.1,51.82 v49.91,55.63 | v52.2,67.44 52.58,67.44 52.96,67.82 56.01,67.82 58.29,65.53 58.29,64.77 59.44,63.63 v69.72,63.63
D1  (via drill 0.3)
  Top 0.305: ROE.1 42.67,33.91 42.67,30.86 IC5.13 42.29,30.48 42.29,28.96 v39.24,25.91
  Bottom 0.305: 18.67,9.91 34.67,25.91 v39.24,25.91 | 18.67,9.91 16.76,8 11.81,8 8,11.81 8,16 2.67,21.34 2.67,34.29 11.43,43.05 11.43,46.1 IC8.2 | 18.67,9.91 26.67,1.91 93.73,1.91 97.16,5.33 97.16,10.29 96.01,11.43 94.87,11.43 93.73,12.57 92.96,12.57 EXTOUT.8
D3  (via drill 0.3)
  Top 0.305: v43.43,28.96 43.43,30.48 IC5.12 | v20.95,43.43 19.05,43.43 17.14,45.34 17.14,46.1 IC8.4 | v16.76,9.14 v17.91,8 | v25.53,28.96 v22.48,25.91
  Bottom 0.305: v43.43,28.96 34.67,28.96 30.1,33.53 | 30.1,33.53 20.95,42.67 v20.95,43.43 | v17.91,8 24.77,1.14 93.73,1.14 97.92,5.33 97.92,11.81 95.63,14.1 92.2,14.1 91.44,13.34 91.44,12.19 92.58,11.05 92.58,10.29 EXTOUT.6 | v16.76,9.14 16.76,14.1 22.48,19.81 v22.48,25.91 | 30.1,33.53 v25.53,28.96
D4  (via drill 0.3)
  Top 0.305: v10.67,26.67 v11.81,27.81 | v14.1,9.91 18.67,9.91 26.67,1.91 73.53,1.91 79.25,7.62 v79.25,19.43
  Bottom 0.305: v11.81,27.81 6.48,33.15 6.48,36.58 7.62,37.72 12.57,37.72 19.05,44.2 19.05,46.1 IC8.5 | v10.67,26.67 10.67,13.34 v14.1,9.91 | v79.25,19.43 74.3,24.38 74.3,25.53 73.53,26.29 71.63,26.29 70.48,27.43 70.48,36.2 72.01,37.72 IC7.9
D12
  Bottom 0.305: LCD.16 56.01,65.53 54.48,67.06 52.96,67.06 52.2,66.29 52.2,64.01 53.72,62.48 53.72,48.01 52.2,46.48 IC8.18
D13  (via drill 0.3)
  Top 0.305: v19.81,58.29 20.95,58.29 23.24,60.58 23.24,65.15 LCD.3 | v17.53,43.81 18.67,42.67 23.62,42.67 27.05,39.24 v27.05,27.43 | v53.72,39.24 53.72,41.15 54.86,42.29 54.86,46.1 IC8.19
  Bottom 0.305: v19.81,58.29 19.81,48.77 17.91,46.86 17.91,44.2 v17.53,43.81 | v27.05,27.43 43.81,27.43 49.91,33.53 49.91,35.81 53.34,39.24 v53.72,39.24
D14
  Top 0.305: RQ.1 65.91,55.63 65.53,55.24 63.25,55.24 62.1,54.1 Q1.1 61.72,53.72 57.53,49.53 57.53,46.48 IC8.20
D15  (via drill 0.3)
  Top 0.305: v42.67,41.91 41.15,41.91 RD-.1
  Bottom 0.305: v42.67,41.91 48.77,41.91 50.29,40.39 51.44,40.39 56.39,45.34 56.39,60.58 57.15,61.34 IC8.21
D18
  Top 0.305: LCD.6 30.86,65.53 32.38,67.06 33.91,67.06 34.67,66.29 34.67,63.63 35.81,62.48 35.81,60.58 37.72,58.67 46.86,58.67 49.53,61.34 IC8.24
D19  (via drill 0.3)
  Top 0.305: v31.62,57.15 43.05,57.15 v43.81,57.91
  Bottom 0.305: v31.62,57.15 28.19,60.58 28.19,62.87 25.91,65.15 LCD.4 | v43.81,57.91 47.24,61.34 IC8.25
D20
  Bottom 0.305: LCD.11 43.43,65.15 43.43,62.87 44.58,61.72 IC8.26
D21  (via drill 0.3)
  Top 0.305: v41.15,32.38 41.15,30.86 IC5.14 | LCD.12 45.72,65.15 42.29,61.72 IC8.27
  Bottom 0.305: v41.15,32.38 41.15,53.34 42.29,54.48 42.29,61.34 IC8.27
D22  (via drill 0.3)
  Top 0.305: v44.96,32.38 44.96,30.86 IC5.11 44.96,30.48 44.96,29.72 48.01,26.67 v49.53,26.67 | IC8.28 40.01,61.34 41.91,59.44 44.96,59.44 46.1,60.58 46.1,62.87 48.39,65.15 LCD.13 | v89.92,4.95 92.58,7.62 EXTOUT.4
  Bottom 0.305: v44.96,32.38 41.91,35.43 41.91,43.43 43.43,44.96 43.43,55.24 48.39,60.2 48.39,65.15 LCD.13 | v89.92,4.95 73.15,4.95 70.48,7.62 70.48,11.81 55.63,26.67 v49.53,26.67
D23
  Top 0.305: LCD.14 50.67,65.53 49.15,67.06 40.39,67.06 39.62,66.29 39.62,64.01 37.34,61.72 IC8.29
GND  (via drill 0.3)
  Top 0.305: 81.92,40.01 80.01,40.01 IC7.21 80.01,40.39 80.01,42.67 IC7.22 | 81.92,40.01 83.82,40.01 | 83.82,40.01 85.72,41.91 89.92,41.91 C7.1 | 83.82,40.01 CX4.2 | 81.92,40.01 81.92,34.67 80.01,32.77 IC7.18 79.63,32.77 75.82,32.77 | EXTOUT.5 95.63,10.29 95.63,12.57 EXTOUT.7 95.25,12.95 94.11,14.1 | 94.11,14.1 92.96,15.24 91.44,15.24 RJ45.SHIELD1 91.06,15.24 86.87,15.24 86.49,14.86 86.49,11.05 85.34,9.91 82.3,9.91 | RJ45.Y- 99.06,27.43 99.06,19.81 RJ45.G- 98.68,19.43 98.68,18.67 94.11,14.1 | CX3.2 84.2,54.1 84.2,54.48 84.96,55.24 89.92,55.24 C8.1 90.3,54.86 90.3,54.48 v91.06,53.72 | RJ45.GND 85.34,28.19 88.01,28.19 91.06,31.24 RJ45.SHIELD0 | 56.39,27.43 57.15,28.19 IC3.6 57.15,28.57 57.91,28.57 IC3.7 58.29,28.57 59.44,28.57 | 56.39,27.43 C9.2 | 56.39,27.43 55.63,28.19 IC3.5 | 55.63,37.72 54.48,37.72 IC3.13 | 59.44,37.72 58.29,37.72 IC3.10 57.91,37.72 57.15,37.72 IC3.11 56.77,37.72 55.63,37.72 | 55.63,37.72 IC3.12 | 67.82,71.25 67.82,73.15 67.44,73.53 U1.P$1 | 67.82,71.25 67.82,65.53 | 67.82,65.53 67.82,64.01 U1.GND3 | 67.82,71.25 53.34,71.25 P1.1 | 68.58,54.1 66.29,54.1 RQ.2 65.91,54.1 64.01,54.1 Q1.2 63.63,53.72 59.44,49.53 59.44,38.1 | 68.58,54.1 68.96,54.1 CAP.2 | CAP.2 69.34,54.1 70.48,55.24 72.01,55.24 IC7.2 72.39,55.63 78.11,61.34 78.11,63.25 U1.6 78.49,63.63 78.49,64.39 79.63,65.53 | 68.58,54.1 68.58,51.05 ISP.6 | 68.58,54.1 CAP.2 | 82.68,68.58 82.68,73.53 U1.P$2 | 82.68,68.58 82.68,64.39 U1.GND1 | 82.68,68.58 79.63,65.53 | 79.63,65.53 67.82,65.53 | 59.44,38.1 59.44,37.72 | 59.44,37.72 IC3.9 59.44,38.1 | CX2.2 43.81,51.05 41.91,51.05 CX1.2 41.53,50.67 41.53,50.29 39.24,48.01 36.2,48.01 35.05,46.86
  Top 0.305: 35.05,46.86 34.67,46.48 IC8.11 35.05,46.86 | LCD.1 17.91,65.53 17.91,70.87 P0.14 | C6.2 26.29,54.86 26.29,52.2 C4.2 25.91,51.82 v28.57,49.15 | C5.2 24,55.24 25.91,55.24 C6.2 | 32,61.72 IC8.31 32.38,61.34 26.29,55.24 C6.2 | 17.91,34.67 17.91,36.96 IC1.6 | 17.91,34.67 17.91,32.38 | 17.91,32.38 17.91,30.1 | 17.91,30.1 17.91,28.57 IC1.3 | 17.91,32.38 9.14,32.38 8,33.53 USB.GND | 17.91,32.38 IC1.6 | V0.2 7.24,8 9.91,8 11.81,9.91 C2.- 12.19,10.29 14.48,12.57 18.67,12.57 | 18.67,12.57 19.05,12.57 C3.- 18.67,12.57 | 18.67,12.57 14.1,17.14 | 14.1,17.14 12.19,19.05 C1.- | 14.1,17.14 17.53,20.57 IC2.1 20.95,24 D3.A 21.34,24 21.34,28.19 IC1.5 21.72,28.57 20.19,30.1 17.91,30.1 | 17.91,34.67 v24,40.77 | 17.91,34.67 IC1.6 | 31.24,16 27.05,16 D2.A 26.67,15.62 24.77,13.72 23.62,13.72 20.57,10.67 12.95,10.67 9.91,13.72 9.91,21 | 31.24,16 32.77,17.53 V1.1 | 31.24,16 31.24,10.29 T1.1 | 36.58,14.86 36.58,16.38 37.72,17.53 V2.1 | 36.58,14.86 36.58,10.29 T2.1 | 36.58,14.86 41.15,10.29 T3.1 | 56.77,14.86 56.77,16.76 57.53,17.53 V6.1 | 56.77,14.86 56.77,10.29 T6.1 | 56.77,14.86 60.96,10.67 | 60.96,10.67 61.34,10.29 T7.1 60.96,10.67 | 60.96,10.67 63.63,10.67 64.01,10.29 66.29,10.29 T8.1 | v47.62,21.72 47.62,24.38 IC5.8 | 46.86,14.86 46.86,16.76 47.62,17.53 V4.1 | 46.86,14.86 46.86,10.29 T4.1 | 46.86,14.86 51.44,10.29 T5.1 | 82.3,9.91 82.3,3.43 RAIN.1 | 82.3,9.91 81.92,10.29 V9.2 | 65.15,28.57 65.15,32.77 S1.2 | 65.15,28.57 65.15,27.05 S1.1 65.15,26.67 65.15,25.91 66.29,24.77 RBS.2 66.67,24.38 66.67,20.19 | 59.44,28.57 65.15,28.57 | 75.82,32.77 72.39,32.77 IC7.11 | 66.67,17.91 66.67,20.19 | 66.67,20.19 69.34,17.53 | 69.34,17.53 70.87,16 P4.3
  Top 0.305: 75.82,32.77 75.82,24 69.34,17.53 | 66.67,17.91 62.87,17.91 V7.1 | 66.67,17.91 V8.1 | 59.44,28.57 59.44,33.53 61.34,35.43 61.34,36.2 59.44,38.1 | 59.44,28.57 IC3.8 | 35.05,46.86 35.05,40.77 38.86,36.96 38.86,34.29 C10.2
  Bottom 0.305: RJ45.GND 84.96,28.19 84.2,28.19 80.01,32.38 IC7.18 | 94.49,41.53 91.44,38.48 91.44,35.05 | 94.49,41.53 98.68,45.72 B3.2 | 91.44,35.05 91.44,31.62 RJ45.SHIELD0 | 94.49,51.05 98.68,55.24 98.68,56.01 B2.2 | 94.49,41.53 94.49,51.05 | 94.49,51.05 94.49,53.72 | 94.49,53.72 94.49,61.34 98.68,65.53 98.68,66.29 B1.2 | 94.49,53.72 v91.06,53.72 | 91.44,35.05 98.68,27.81 RJ45.Y- | IC8.31 32,61.34 28.19,65.15 LCD.5 27.81,65.53 26.29,67.06 21.72,67.06 17.91,70.87 P0.14 | IC8.11 34.29,46.48 31.62,49.15 v28.57,49.15 28.57,47.62 28.19,47.24 28.19,44.96 v24,40.77 | POWER.1 3.43,17.91 6.86,14.48 6.86,8 V0.2 | V1.1 33.15,17.91 37.72,17.91 V2.1 38.1,17.91 42.67,17.91 V3.1 43.05,17.91 47.62,17.91 | 47.62,17.91 v47.62,21.72 | 47.62,17.91 V4.1 48.01,17.91 52.58,17.91 V5.1 52.96,17.91 57.53,17.91 V6.1 57.91,17.91 62.48,17.91 V7.1 | BAT1.P$1 62.1,25.53 62.1,22.48 66.67,17.91 V8.1
  pour Top (isolate 0.61): 0,50 28,50 28,21 0,21
  pour Top (isolate 0.61): 48.26,39.37 63.5,39.37 63.5,25.4 48.26,25.4
INT0
  Top 0.305: RD+.1 41.15,39.24 47.24,45.34 47.24,46.1 IC8.16
INT1  (via drill 0.3)
  Top 0.305: v89.15,10.67 87.63,9.14 RZ.2 | v75.06,24.77 73.53,26.29 v70.1,26.29 | v48.39,35.81 v60.58,35.81 | v48.39,41.15 48.39,44.96 49.53,46.1 IC8.17
  Bottom 0.305: v75.06,24.77 v89.15,10.67 | v60.58,35.81 v70.1,26.29 | v48.39,41.15 v48.39,35.81
INT2  (via drill 0.3)
  Top 0.305: v36.96,67.44 39.62,67.44 43.05,70.87 P0.4
  Bottom 0.305: v36.96,67.44 34.29,70.1 34.29,71.63 32.77,73.15 17.91,73.15 15.62,70.87 15.62,60.58 14.48,59.44 14.48,46.48 IC8.3
LEDA
  Top 0.305: REA.2 89.53,11.81 92.2,9.14 96.01,9.14 98.68,11.81 98.68,16.76 RJ45.G+
LEDB
  Top 0.305: REB.2 85.72,12.19 85.72,14.86 97.54,26.67 97.54,28.96 98.68,30.1 RJ45.Y+
MISO
  Top 0.305: 79.25,62.1 79.25,59.82 74.3,54.86 74.3,47.62 72.39,45.72 IC7.6 | 79.25,62.1 79.25,63.25 U1.7 | 79.25,62.1 82.68,62.1 83.82,63.25 83.82,75.06 66.29,75.06 65.53,74.3 65.53,73.15 64.77,72.39 52.2,72.39 51.05,71.25 P0.1
  Bottom 0.305: ISP.1 63.63,48.39 64.39,48.39 65.53,49.53 68.96,49.53 70.48,48.01 70.48,47.24 72.01,45.72 IC7.6 | IC8.7 24.77,46.48 29.72,51.44 32,51.44 41.15,60.58 41.15,63.25 42.29,64.39 42.29,66.29 45.72,69.72 49.53,69.72 50.67,70.87 P0.1
MOSI  (via drill 0.3)
  Top 0.305: IC7.7 72.01,43.05 69.72,45.34 69.72,48.77 68.96,49.53 67.44,49.53 66.29,50.67 ISP.4 | v75.06,62.1 75.06,63.25 U1.3 | v64.01,70.48 54.48,70.48 52.96,68.96 50.29,68.96 48.39,70.87 P0.2
  Bottom 0.305: IC8.6 22.1,46.48 22.1,46.86 28.57,53.34 29.72,53.34 35.81,59.44 35.81,63.25 36.96,64.39 36.96,66.29 40.39,69.72 41.15,69.72 41.91,70.48 41.91,71.63 42.67,72.39 46.86,72.39 48.01,71.25 P0.2 | v75.06,62.1 73.91,62.1 73.15,61.34 | 73.15,61.34 66.29,54.48 66.29,51.05 ISP.4 | v64.01,70.48 73.15,61.34
N$1
  Top 0.508: 9.91,23.62 11.05,23.62 11.81,22.86 C1.+ | 9.91,23.62 6.1,23.62 D1.C | 9.91,23.62 14.48,28.19 IC1.1
N$2  (via drill 0.3)
  Top 0.508: L1.2 30.86,27.81 24,20.95 24,20.19 F1.1 23.62,19.81 v21.34,19.81 | IC1.4 19.43,28.19 19.43,23.62 17.91,22.1 13.34,22.1 11.81,20.57 11.43,20.57 10.67,19.81 10.67,15.24 11.81,14.1 C2.+
  Bottom 0.508: v21.34,19.81 17.91,19.81 12.19,14.1 C2.+
N$3
  Top 0.305: R1.1 33.91,19.81 33.91,15.62 33.15,14.86 33.15,9.14 T1.2
N$4  (via drill 0.3)
  Top 0.305: v49.15,22.86 51.82,20.19 R6.2 | v44.58,22.86 43.81,23.62 43.81,24.38 IC5.5
  Bottom 0.305: v44.58,22.86 v49.15,22.86
N$5  (via drill 0.3)
  Top 0.305: v54.1,22.1 56.01,20.19 R7.2 | v46.1,26.29 44.96,25.15 44.96,24.77 IC5.6
  Bottom 0.305: v54.1,22.1 52.96,22.1 48.77,26.29 v46.1,26.29
N$6
  Bottom 0.508: J2.2 1.91,54.1 1.91,53.34 4.19,51.05 4.19,44.58 0.76,41.15 0.76,16.76 3.05,14.48 POWER.2
N$7  (via drill 0.3)
  Top 0.305: v57.15,22.86 59.82,20.19 R8.2 | v50.29,25.91 46.86,25.91 46.48,25.53 46.48,24.77 IC5.7
  Bottom 0.305: v57.15,22.86 53.34,22.86 v50.29,25.91
N$8  (via drill 0.3)
  Top 0.305: v52.96,40.01 52.96,37.72 IC3.14
  Bottom 0.305: v52.96,40.01 60.2,40.01 61.72,41.53 BAT1.P$2
N$9  (via drill 0.3)
  Top 0.508: D3.C 16.76,24 16.76,27.81 16.38,28.19 IC1.2 16.38,28.57 16.38,29.72 v17.14,30.48 | v28.19,33.53 28.19,35.05 30.86,37.72 L1.1
  Bottom 0.508: v17.14,30.48 25.15,30.48 v28.19,33.53
N$10
  Top 0.305: R5.2 48.01,20.19 46.1,22.1 44.2,22.1 42.67,23.62 42.67,24.38 IC5.4
N$11
  Top 0.305: R4.2 43.81,20.19 43.81,20.95 41.15,23.62 41.15,24.38 IC5.3
N$12
  Top 0.305: R3.2 40.01,20.19 40.01,24.38 IC5.2
N$13
  Top 0.305: R2.2 36.2,20.19 36.2,22.1 38.48,24.38 IC5.1
N$14
  Top 0.305: R1.2 32.38,20.19 32.38,22.1 39.62,29.34 39.62,30.48 IC5.15
N$15
  Top 0.305: R2.1 37.72,19.81 37.72,19.43 35.43,17.14 35.43,11.05 35.05,10.67 35.05,7.24 36.2,6.1 36.96,6.1 38.1,7.24 38.1,8.76 T2.2
N$16
  Top 0.508: V1.2 29.34,14.1 29.34,10.67 30.1,9.91 30.1,9.14 31.24,8 T1.3 31.62,7.62 32,7.24 32,3.43 S12.1
N$17
  Bottom 0.508: V2.2 34.29,14.1 34.29,10.29 36.58,8 T2.3 36.58,7.62 37.34,6.86 37.34,3.43 S12.2
N$18
  Top 0.508: S34.1 42.29,3.43 42.29,6.86 41.53,7.62 T3.3
  Bottom 0.508: V3.2 39.24,14.1 39.24,10.29 41.53,8 T3.3
N$19
  Top 0.305: RBS.1 68.58,24.77 72.01,24.77 IC7.14
N$20
  Bottom 0.508: V4.2 44.58,14.1 44.58,9.91 46.48,8 T4.3 46.86,7.62 47.24,7.24 47.24,3.43 S34.2
N$21
  Top 0.305: R3.1 41.91,19.81 41.91,18.67 41.53,18.29 41.53,12.19 43.05,10.67 43.05,9.14 T3.2
N$22
  Top 0.508: S56.1 52.58,3.43 52.58,6.86 51.82,7.62 T5.3
  Bottom 0.508: V5.2 49.53,14.1 49.53,9.91 51.44,8 T5.3
N$23
  Bottom 0.508: V6.2 54.48,14.1 54.48,9.91 56.39,8 T6.3 56.77,7.62 57.53,6.86 57.53,3.43 S56.2
N$24
  Top 0.508: S78.1 62.48,3.43 62.48,6.86 61.72,7.62 T7.3
  Bottom 0.508: V7.2 59.44,14.1 59.44,10.29 61.72,8 T7.3
N$25
  Bottom 0.508: V8.2 63.25,14.1 63.25,11.43 66.67,8 T8.3 66.67,7.62 67.82,6.48 67.82,3.43 S78.2
N$26
  Top 0.305: R4.1 45.72,19.81 45.72,11.43 44.96,10.67 44.96,7.24 46.1,6.1 46.86,6.1 48.39,7.62 48.39,8.76 T4.2
N$27
  Top 0.305: R5.1 50.29,19.81 50.29,13.34 53.34,10.29 53.34,9.14 T5.2
N$28
  Top 0.305: R6.1 54.1,19.81 54.1,15.62 52.96,14.48 52.96,11.43 54.86,9.53 54.86,7.24 56.01,6.1 56.77,6.1 58.29,7.62 58.29,8.76 T6.2
N$29
  Top 0.305: R7.1 58.29,19.81 62.87,15.24 64.01,15.24 69.72,9.53 69.72,8.38 67.44,6.1 66.29,6.1 63.63,8.76 T7.2
N$31
  Top 0.305: 89.15,6.86 89.15,4.95 87.63,3.43 RAIN.2 | 89.15,6.86 89.15,8.76 RZ.1 | 89.15,6.86 85.34,6.86 V9.1
N$32  (via drill 0.3)
  Top 0.508: v1.52,40.77 1.52,44.58 4.19,47.24 4.19,48.77 1.91,51.05 J2.3
  Bottom 0.508: v1.52,40.77 1.52,17.14 2.29,16.38 3.43,16.38 5.71,14.1 5.71,3.81 F0.1
N$33
  Top 0.305: CAP.1 69.34,56.01 70.1,56.01 72.01,57.91 IC7.1
N$34  (via drill 0.3)
  Top 0.305: v87.25,14.48 87.25,12.19 REA.1 | v77.34,32 v77.34,24.38 | v77.34,36.2 77.34,37.34 76.58,38.1 76.58,52.2 79.63,55.24 IC7.27
  Bottom 0.305: v77.34,24.38 v87.25,14.48 | v77.34,36.2 v77.34,32
N$35
  Top 0.305: Q1.3 62.87,56.39 62.87,58.67 62.1,59.44 DF.A 61.72,59.82 61.72,64.77 59.82,66.67 59.82,67.44 U$1.9
N$37  (via drill 0.3)
  Top 0.305: v76.58,31.24 76.58,24 80.01,20.57 80.01,16.38 83.44,12.95 83.44,12.19 REB.1 | v76.58,34.29 78.11,35.81 78.11,38.86 77.34,39.62 77.34,50.67 79.63,52.96 IC7.26
  Bottom 0.305: v76.58,34.29 v76.58,31.24
N$38  (via drill 0.3)
  Top 0.305: v42.67,37.72 40.01,37.72 39.24,38.48 39.24,38.86 RD+.2 | v11.05,31.24 8.38,31.24 6.48,33.15 6.48,34.67 7.62,35.81 USB.D+
  Bottom 0.305: v42.67,37.72 42.67,35.81 45.72,32.77 45.72,30.1 43.81,28.19 14.1,28.19 v11.05,31.24
N$41
  Top 0.305: CX3.1 85.72,53.72 85.72,49.91 85.34,49.53 X1.2 84.96,49.15 83.82,48.01 80.01,48.01 IC7.24
N$42  (via drill 0.3)
  Top 0.305: v87.25,41.15 86.11,40.01 CX4.1 | IC7.23 80.01,45.34 84.58,45.34 84.96,44.96 X1.1
  Bottom 0.305: v87.25,41.15 87.25,42.67 85.34,44.58 X1.1
N$43  (via drill 0.3)
  Top 0.305: v68.2,12.19 67.82,12.19 64.01,16 62.87,16 61.72,17.14 61.72,19.81 R8.1
  Bottom 0.305: v68.2,12.19 68.2,9.14 T8.2
N$45  (via drill 0.3)
  Top 0.305: 32,42.29 31.24,42.29 29.34,44.2 21.72,44.2 20.57,45.34 20.57,47.24 19.05,48.77 12.19,48.77 10.29,46.86 10.29,36.2 USB.D- | v35.81,42.29 38.86,42.29 RD-.2 | 32,42.29 v33.15,43.43 | 32,42.29 RUSB.1
  Bottom 0.305: v35.81,42.29 34.29,42.29 v33.15,43.43
N$46
  Top 0.305: CX1.1 40.39,51.05 40.39,54.1 40.77,54.48 X0.2
  Bottom 0.305: IC8.12 37.34,46.48 37.34,51.05 40.77,54.48 X0.2
N$47
  Top 0.305: X0.1 46.1,54.48 46.1,51.05 CX2.1 46.1,50.67 44.96,49.53 43.05,49.53 40.01,46.48 IC8.13
N$54
  Top 0.305: RR+.1 92.2,39.24 92.2,41.91 C7.2 92.2,42.29 92.2,44.96 RR-.2
NC
  Bottom 0.508: U$1.1 64.39,65.53 56.39,73.53 56.39,75.82 JP0.1
NO  (via drill 0.3)
  Top 0.508: v62.87,68.58 v61.34,67.06 | v59.05,77.72 47.62,77.72 46.1,76.2 JP1.1
  Bottom 0.508: v61.34,67.06 59.82,65.53 U$1.10 | v62.87,68.58 62.87,73.91 v59.05,77.72
QH*  (via drill 0.3)
  Top 0.305: v49.53,32 48.39,33.15 47.24,33.15 46.86,32.77 46.86,32 47.24,31.62 47.24,30.86 IC5.9 | v80.39,14.86 80.39,2.67 81.15,1.91 89.53,1.91 92.58,4.95 EXTOUT.2
  Bottom 0.305: v49.53,32 63.25,32 v80.39,14.86
RD+  (via drill 0.3)
  Top 0.305: RR+.2 90.3,38.86 90.3,36.2 96.39,30.1 96.39,28.19 89.92,21.72 88.01,21.72 RJ45.RD+ 87.63,21.34 86.49,20.19 86.49,19.81 v85.72,19.05
  Bottom 0.305: v85.72,19.05 83.82,19.05 75.44,27.43 72.39,27.43 IC7.13
RD-  (via drill 0.3)
  Top 0.305: v82.3,40.77 82.68,40.77 86.87,44.96 89.92,44.96 RR-.1 | v78.11,26.29 81.15,26.29 81.92,25.53 84.96,25.53 RJ45.RD-
  Bottom 0.305: v82.3,40.77 82.3,40.39 80.77,38.86 78.87,38.86 74.3,34.29 74.3,32.38 73.15,31.24 | 73.15,31.24 72.39,30.48 IC7.12 | 73.15,31.24 v78.11,26.29
RESET  (via drill 0.3)
  Top 0.305: RR.2 24,51.82 29.34,46.48 IC8.9 | S1.3 68.2,27.05 68.2,32.77 S1.4 68.2,33.15 71.25,36.2 | 71.25,36.2 68.58,38.86 68.58,48.01 ISP.5 | 71.25,36.2 72.01,35.43 IC7.10 | v39.62,36.2 v43.43,36.2
  Bottom 0.305: v43.43,36.2 44.58,35.05 48.77,35.05 49.15,35.43 49.15,37.34 56.01,44.2 63.25,44.2 68.2,39.24 73.15,39.24 74.3,38.1 74.3,37.34 72.39,35.43 IC7.10 | v39.62,36.2 33.15,42.67 32.77,42.67 29.34,46.1 IC8.9
RXD  (via drill 0.3)
  Top 0.305: v54.86,68.96 54.86,64.39 53.72,63.25 53.72,60.58 50.67,57.53 50.67,53.72 45.72,48.77 44.58,48.77 42.29,46.48 IC8.14
  Bottom 0.305: v54.86,68.96 54.86,71.63 54.1,72.39 47.62,72.39 46.86,73.15 40.01,73.15 38.1,71.25 P0.6
SCK  (via drill 0.3)
  Top 0.305: U1.5 76.96,63.25 76.96,61.34 v75.06,59.44 70.48,59.44 65.91,64.01 65.91,68.2 64.39,69.72 54.48,69.72 52.96,68.2 48.39,68.2 45.72,70.87 P0.3
  Bottom 0.305: ISP.3 66.29,48.01 66.29,46.1 72.01,40.39 IC7.8 72.39,40.39 75.06,43.05 v75.06,59.44 | IC8.8 26.67,46.1 24.77,44.2 24,44.2 23.24,44.96 23.24,47.24 28.57,52.58 30.48,52.58 38.48,60.58 38.48,63.25 39.62,64.39 39.62,66.29 43.05,69.72 44.58,69.72 45.72,70.87 P0.3
SCL  (via drill 0.3)
  Top 0.305: RCL.2 54.1,55.24 54.1,60.2 55.24,61.34 IC8.22 55.24,61.72 58.29,64.77 v58.29,68.96 | v50.67,41.15 50.67,37.72 IC3.16 | v34.67,77.72 28.19,71.25 P0.10
  Bottom 0.305: v50.67,41.15 50.67,42.29 53.72,45.34 53.72,47.24 54.86,48.39 54.86,61.34 IC8.22 | v34.67,77.72 47.24,77.72 51.82,73.15 54.1,73.15 v58.29,68.96
SDA  (via drill 0.3)
  Top 0.305: 53.72,50.67 53.72,41.91 51.82,40.01 51.82,37.72 IC3.15 | 53.72,50.67 53.72,51.82 RDA.2 | 53.72,50.67 v52.58,50.67 | v21.72,66.29 25.15,69.72 25.15,70.87 P0.11 | v49.15,56.39 v30.86,56.39
  Bottom 0.305: v52.58,50.67 52.58,56.39 | 52.58,56.39 52.58,61.34 IC8.23 | v21.72,66.29 21.72,64.01 23.24,62.48 23.24,60.2 27.05,56.39 v30.86,56.39 | 52.58,56.39 v49.15,56.39
TCT  (via drill 0.3)
  Top 0.305: RT+.1 92.2,52.2 92.2,54.86 C8.2 91.82,55.24 91.82,57.91 RT-.2 91.82,58.29 90.68,59.44 89.53,59.44 88.39,58.29 86.11,58.29 L2.1 86.11,57.91 v83.82,55.63
  Bottom 0.305: v83.82,55.63 83.82,41.15 82.68,40.01 82.68,33.53 86.49,29.72 86.49,25.15 85.34,24 85.34,23.24 RJ45.P4
TD+  (via drill 0.3)
  Top 0.305: v88.39,50.29 89.92,51.82 RT+.2
  Bottom 0.305: v88.39,50.29 88.39,41.15 83.44,36.2 83.44,33.53 88.77,28.19 88.77,20.19 88.01,19.43 RJ45.TD+ 87.63,19.43 85.34,21.72 84.58,21.72 83.82,22.48 83.82,26.29 80.01,30.1 IC7.17
TD-  (via drill 0.3)
  Top 0.305: v89.92,56.39 89.92,57.91 RT-.1 | v84.2,35.81 84.2,32 80.01,27.81 IC7.16
  Bottom 0.305: v89.92,56.39 89.92,41.53 v84.2,35.81 | RJ45.TD- 84.96,20.57 81.92,23.62 81.92,25.53 80.01,27.43 IC7.16
TXD  (via drill 0.3)
  Top 0.305: v51.82,70.1 51.44,69.72 50.29,69.72 49.53,70.48 49.53,71.63 48.77,72.39 41.91,72.39 P0.5
  Bottom 0.305: v51.82,70.1 49.91,68.2 49.91,64.01 51.05,62.87 51.05,60.2 50.29,59.44 48.77,59.44 44.58,55.24 44.58,46.48 IC8.15
VCC  (via drill 0.3)
  Top 0.305: 81.92,57.91 80.01,57.91 IC7.28 | 81.92,57.91 83.82,57.91 L2.2 | 81.92,57.91 81.92,52.58 80.01,50.67 IC7.25 79.63,50.29 78.11,48.77 78.11,39.62 79.63,38.1 IC7.20 80.01,37.72 80.01,35.43 IC7.19 | RPR.2 18.29,54.86 18.29,54.48 20.57,52.2 21.72,52.2 RR.1 22.1,51.82 v23.24,50.67 | IC8.30 34.29,61.34 28.19,55.24 C6.1 28.19,54.86 28.19,52.2 C4.1 28.19,51.82 32,48.01 32,46.48 IC8.10 32.38,46.1 33.91,44.58 33.91,42.29 RUSB.2 34.29,41.91 34.29,36.2 38.86,31.62 | IC2.2 17.91,16 19.05,14.86 C3.+ 19.43,14.48 24,14.48 25.53,16 25.53,17.14 26.29,17.91 29.34,17.91 30.86,19.43 30.86,21.72 | 38.86,31.62 40.77,33.53 40.77,33.91 C10.1 41.15,34.29 42.29,35.43 44.96,35.43 | 38.86,31.62 38.86,30.86 IC5.16 38.86,30.48 30.86,22.48 30.86,21.72 | C9.1 51.05,26.67 51.82,27.43 51.82,28.19 IC3.2 | RCL.1 52.2,54.86 52.2,52.2 RDA.1 51.82,51.82 51.82,48.01 51.05,47.24 51.05,42.67 44.96,36.58 44.96,35.43 | IC5.10 46.1,30.86 46.1,32.77 44.96,33.91 ROE.2 44.96,34.29 44.96,35.43 | 75.82,61.72 75.44,61.34 74.3,61.34 RSD.2 | 75.82,61.72 75.82,63.25 U1.4 | v76.2,61.72 75.82,61.72 | v83.06,14.48 83.06,21.72 80.01,24.77 IC7.15 | v48.39,23.62 50.67,23.62 C9.1 | 30.86,21.72 v31.62,21.72 | v58.29,25.15 56.01,22.86 51.82,22.86 51.05,23.62 C9.1
  Bottom 0.305: IC7.15 79.63,25.15 79.63,25.91 78.11,27.43 78.11,33.53 79.63,35.05 IC7.19 | P0.12 22.86,70.87 23.62,70.87 27.43,67.06 31.24,67.06 32,66.29 32,64.01 34.29,61.72 IC8.30 34.29,61.34 34.29,58.67 29.72,54.1 28.57,54.1 25.15,50.67 v23.24,50.67 | v76.2,61.72 79.63,58.29 IC7.28 | 84.58,14.1 84.2,14.48 v83.06,14.48 | 84.58,14.1 92.2,6.48 93.34,6.48 94.49,5.33 95.25,5.33 EXTOUT.1 | v48.39,23.62 33.53,23.62 v31.62,21.72 | v58.29,25.15 65.53,17.91 65.53,17.53 69.72,13.34 73.53,13.34 74.3,14.1 84.58,14.1
VIN  (via drill 0.3)
  Top 0.508: U$1.2 64.39,67.44 63.25,66.29 63.25,64.77 65.91,62.1 65.91,59.82 DF.C 65.91,59.44 v64.39,59.44 | LCD.2 20.57,65.53 20.57,70.87 P0.13 | 23.24,16 20.19,19.05 20.19,19.81 IC2.3 | 23.24,16 27.05,19.81 27.81,19.81 F1.2 28.19,20.19 v28.19,24 | 23.24,16 D2.C | v66.29,27.81 66.29,46.1 64.77,47.62 64.77,49.53 63.63,50.67 ISP.2
  Bottom 0.508: 63.25,58.29 58.29,63.25 55.63,63.25 53.72,65.15 LCD.15 | 63.25,58.29 63.25,51.05 ISP.2 | 63.25,58.29 v64.39,59.44 | LCD.2 20.57,65.15 20.57,44.2 10.29,33.91 USB.VBUS 10.29,33.53 10.29,30.86 13.72,27.43 24.77,27.43 v28.19,24 31.62,24 34.29,26.67 45.34,26.67 46.86,28.19 65.91,28.19 v66.29,27.81 73.15,20.95 73.15,16 P4.2

### Text on the board
tNames: OpenSprinkler DIY v2.1u | www.opensprinkler.com | NO | CO | NC | (Rev. 11/13) | GND VIN VCC SDA SCL A05 A06 A07 RXD TXD IN2 SCK MSI MSO GND | ISP | RESET | POWER | GND VIN A3 | RF | COM | EXTOUT | S1-8 | Rain
BoxDim: Serpac WM-032C Enclosure | All units are in inch | Left | Right | Front | Bottom